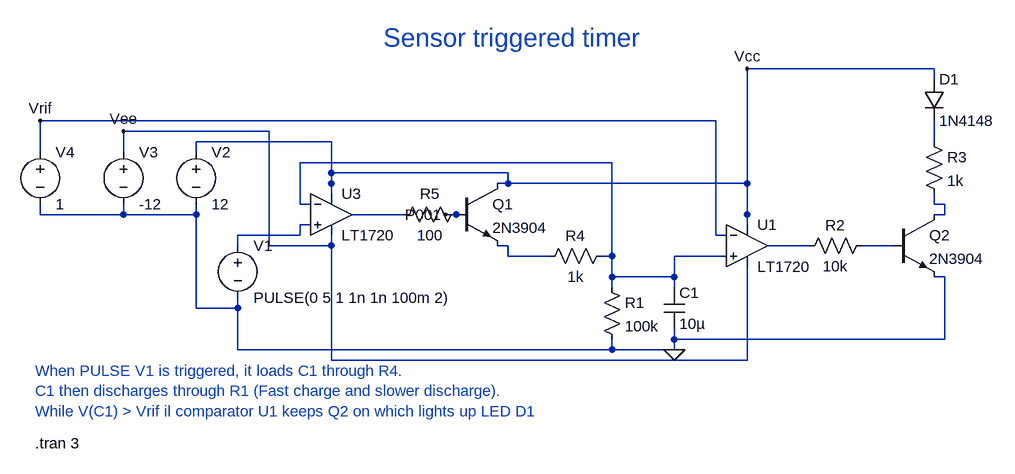
[diagram p0: schematic Sensor-triggered-timer-temporizzatore-1.asc]
Sensor-triggered-timer-temporizzatore-1.asc, the LTspice schematic file:
Version 4.1
SHEET 1 1152 680
WIRE 656 272 656 288
WIRE 1056 192 1072 192
WIRE 560 288 560 304
WIRE -16 224 -16 240
WIRE -80 80 -80 96
WIRE -192 80 -192 96
WIRE -320 80 -320 96
WIRE 656 288 656 304
WIRE 656 304 560 304
WIRE 656 288 1072 288
WIRE 1072 288 1072 192
WIRE 560 304 -16 304
WIRE -16 304 -16 240
WIRE -16 240 -80 240
WIRE -80 240 -80 96
WIRE -80 96 -192 96
WIRE -192 96 -320 96
FLAG 656 304 0
WIRE 656 208 656 192
WIRE 560 208 560 192
WIRE 544 160 560 160
WIRE 736 160 720 160
WIRE 96 80 80 80
WIRE 656 192 560 192
WIRE 560 192 560 160
WIRE 656 192 656 160
WIRE 656 160 720 160
WIRE 560 160 560 16
WIRE 560 16 80 16
WIRE 80 16 80 80
WIRE 1056 -48 1056 -32
WIRE 1056 -16 1056 -32
WIRE 240 96 224 96
WIRE 160 96 176 96
WIRE 224 96 176 96
WIRE 1056 96 1072 96
WIRE 1056 64 1056 80
WIRE 1072 96 1072 80
WIRE 1072 80 1056 80
WIRE 96 112 80 112
WIRE -16 144 -16 128
WIRE 80 112 80 128
WIRE 80 128 -16 128
WIRE 864 144 848 144
WIRE 800 144 816 144
WIRE 848 144 816 144
WIRE 992 144 976 144
WIRE 944 144 960 144
WIRE 976 144 960 144
WIRE 384 144 400 144
WIRE 464 160 448 160
WIRE 400 144 400 160
WIRE 400 160 448 160
WIRE 320 96 304 96
WIRE 320 96 336 96
FLAG 304 96 P001
WIRE 1056 -112 1056 -128
WIRE 384 48 400 48
WIRE 768 112 768 96
WIRE 128 64 128 48
WIRE -80 0 -80 -16
WIRE 1056 -128 768 -128
WIRE 768 -128 768 96
WIRE 768 96 768 48
WIRE 768 48 400 48
WIRE 400 48 400 32
WIRE 400 32 128 32
WIRE 128 32 128 48
WIRE 128 48 128 -16
WIRE 128 -16 -80 -16
FLAG 768 -128 Vcc
WIRE 768 176 768 192
WIRE 128 128 128 144
WIRE -192 0 -192 -16
WIRE 768 192 768 320
WIRE 768 320 128 320
WIRE 128 320 128 144
WIRE 128 144 32 144
WIRE 32 144 32 -32
WIRE 32 -32 -192 -32
WIRE -192 -32 -192 -16
FLAG -192 -32 Vee
WIRE 736 128 720 128
WIRE -320 0 -320 -16
WIRE 720 128 720 -48
WIRE 720 -48 -320 -48
WIRE -320 -48 -320 -16
FLAG -320 -48 Vrif
SYMBOL voltage -16 128 R0
WINDOW 123 0 0 Left 2
WINDOW 39 0 0 Left 2
SYMATTR InstName V1
SYMATTR Value PULSE(0 5 1 1n 1n 100m 2)
SYMBOL npn 320 48 R0
SYMATTR InstName Q1
SYMATTR Value 2N3904
SYMBOL res 544 192 R0
SYMATTR InstName R1
SYMATTR Value 100k
SYMBOL cap 640 208 R0
SYMATTR InstName C1
SYMATTR Value 10µ
SYMBOL voltage -80 -16 R0
WINDOW 123 0 0 Left 2
WINDOW 39 0 0 Left 2
SYMATTR InstName V2
SYMATTR Value 12
SYMBOL res 960 128 R90
WINDOW 0 0 56 VBottom 2
WINDOW 3 32 56 VTop 2
SYMATTR InstName R2
SYMATTR Value 10k
SYMBOL npn 992 96 R0
SYMATTR InstName Q2
SYMATTR Value 2N3904
SYMBOL res 1040 -32 R0
SYMATTR InstName R3
SYMATTR Value 1k
SYMBOL diode 1040 -112 R0
SYMATTR InstName D1
SYMATTR Value 1N4148
SYMBOL res 560 144 R90
WINDOW 0 0 56 VBottom 2
WINDOW 3 32 56 VTop 2
SYMATTR InstName R4
SYMATTR Value 1k
SYMBOL res 336 80 R90
WINDOW 0 0 56 VBottom 2
WINDOW 3 32 56 VTop 2
SYMATTR InstName R5
SYMATTR Value 100
SYMBOL Comparators\\LT1720 128 32 R0
SYMATTR InstName U3
SYMBOL voltage -192 -16 R0
WINDOW 123 0 0 Left 2
WINDOW 39 0 0 Left 2
SYMATTR InstName V3
SYMATTR Value -12
SYMBOL Comparators\\LT1720 768 80 R0
SYMATTR InstName U1
SYMBOL voltage -320 -16 R0
WINDOW 123 0 0 Left 2
WINDOW 39 0 0 Left 2
SYMATTR InstName V4
SYMATTR Value 1
TEXT -328 448 Left 2 !.tran 3
TEXT -328 336 Left 2 ;When PULSE V1 is triggered, it loads C1 through R4.\nC1 then discharges through R1 (Fast charge and slower discharge).\nWhile V(C1) > Vrif il comparator U1 keeps Q2 on which lights up LED D1
TEXT 208 -176 Left 4 ;Sensor triggered timer

The netlist it stands for:
* Sensor-triggered-timer-temporizzatore-1.asc
V1 N005 0 PULSE(0 5 1 1n 1n 100m 2)
Q1 Vcc P001 N008 0 2N3904
R1 N001 0 100k
C1 N001 0 10µ
V2 Vcc 0 12
R2 N007 N006 10k
Q2 N004 N007 0 0 2N3904
R3 N002 N004 1k
D1 Vcc N002 1N4148
R4 N001 N008 1k
R5 P001 N003 100
X§U3 N005 N001 Vcc Vee N003 LT1720  ; pins In+ In- V+ V- OUT
V3 Vee 0 -12
X§U1 N001 Vrif Vcc Vee N006 LT1720  ; pins In+ In- V+ V- OUT
V4 Vrif 0 1
.model D D
.lib standard.dio
.model NPN NPN
.model PNP PNP
.lib standard.bjt
.tran 3
* When PULSE V1 is triggered, it loads C1 through R4.
* C1 then discharges through R1 (Fast charge and slower discharge).
* While V(C1) > Vrif il comparator U1 keeps Q2 on which lights up LED D1
* Sensor triggered timer
.lib LT1720.sub
.backanno
.end